# EAGLE design Final (EAGLE 9.3.0)
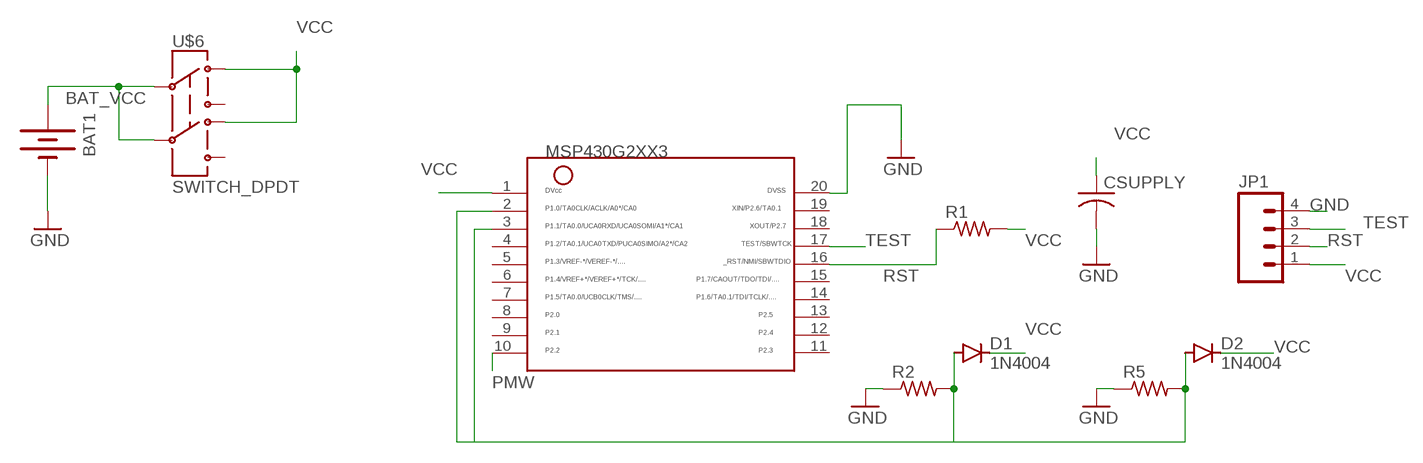
[diagram p0: schematic, sheet 1]

## Parts
BAT1  BATTERY  [BATTERY_PACK_2AA]
CSUPPLY  C-USC1206  [C1206]
D1  1N4004  [DO41-10]
D2  1N4004  [DO41-10]
JP1  M04LOCK  [1X04_LOCK]
R1  R-US_R1206  [R1206]
R2  R-US_R1206  [R1206]
R5  R-US_R1206  [R1206]
U$1  MSP430G2XX3TSSOP  [PW20]
U$6  SWITCH_DPDT  [JS_DPDT_TH]

## Nets
BAT_VCC: BAT1.3V(+) U$6.2 U$6.5
GND: BAT1.GND(-) CSUPPLY.2 JP1.4 R2.1 R5.1 U$1.20
N$1: D1.A R2.2 U$1.2
N$3: D2.A R5.2 U$1.3
PMW: U$1.10
RST: JP1.2 R1.1 U$1.16
TEST: JP1.3 U$1.17
VCC: CSUPPLY.1 D1.C D2.C JP1.1 R1.2 U$1.1 U$6.1 U$6.4
Unconnected: U$1.4 U$1.5 U$1.6 U$1.7 U$1.8 U$1.9 U$1.11 U$1.12 U$1.13 U$1.14 U$1.15 U$1.18 U$1.19 U$6.3 U$6.6

## Library data of the parts
BAT1 = ELEC327:BATTERY: Battery Holders Various common sizes : AA, AAA, 20mm coin cell and 12mm coin cell. 20MM_4LEGS, BATT-10373
CSUPPLY = rcl:C-US: CAPACITOR, American symbol
D1 D2 = diode:1N4004: DIODE general purpose rectifier, 1 A
JP1 = SparkFun:M04: Header 4 Standard 4-pin 0.1" header. Use with straight break away headers (SKU : PRT-00116), right angle break away headers (PRT-00553), swiss pins (PRT-00743), machine pins (PRT-00117), and female headers (PRT-00115). Molex polarized connector foot print use with SKU : PRT-08231 with associated crimp pins and housings. 1MM SMD Version SKU: PRT-10208
R1 R2 R5 = resistor:R-US_: RESISTOR, American symbol
U$1 = ELEC327:MSP430G2XX3: MSP430G2XX3 PDIP (N) 20 Pin Package
U$6 = ELEC327:SWITCH_DPDT

## Board
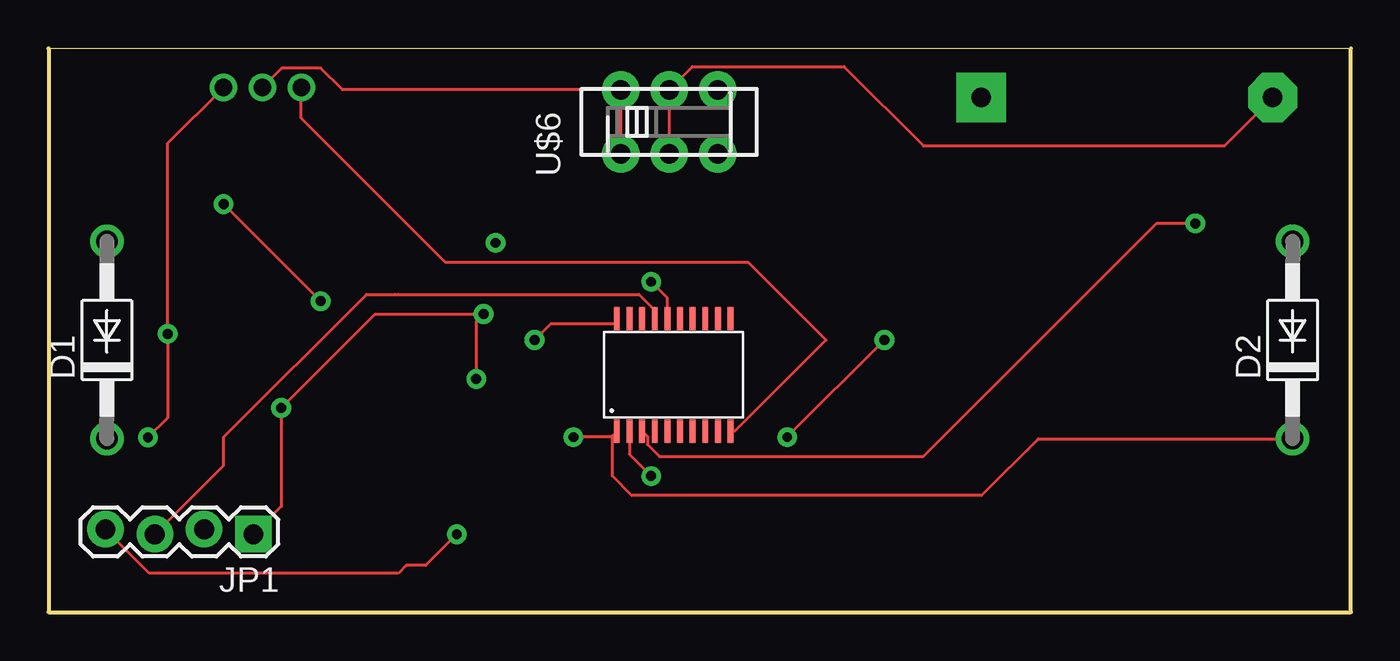
[diagram p1: board, top side]
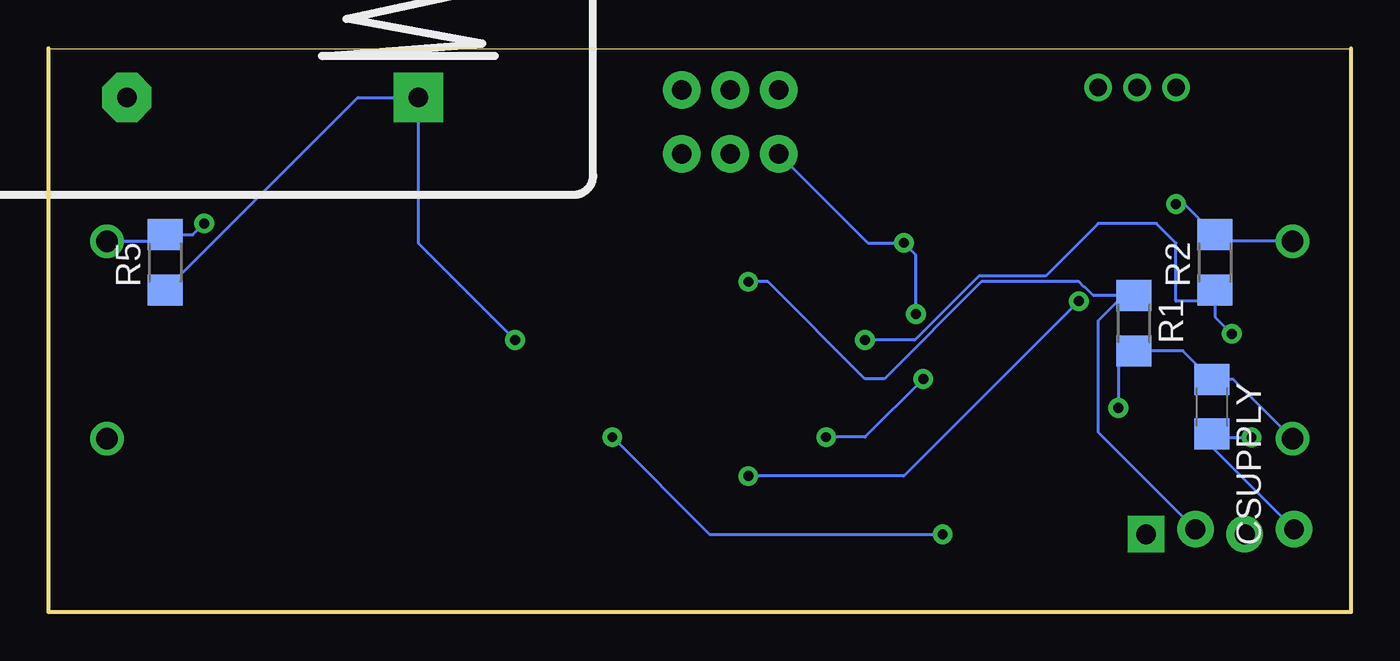
[diagram p2: board, bottom side, seen from below]

Size 67 x 29 mm. Coordinates in mm from the lower left corner, seen from the top.
Outline: 0,0 67,0 67,29 0,29 0,0
Copper layers (1*16): Top 0.035mm / dielectric 1.5mm / Bottom 0.035mm
Design rules "AdvancedCircuitsBarebones": minimum track width 6mil, minimum drill 20mil, track to track 6mil, track to pad 6mil, pad to pad 6mil, via to via 6mil, smd to smd 6mil, copper to edge 10mil, drill to drill 6mil, minimum pad ring 12mil, minimum via ring 10mil, stop-mask expansion 4mil, vias tented up to drill 25mil, thermal gap 10mil

### Footprints (pad centres in the part's own frame; a part is rotated, then mirrored left to right if it is on the bottom)
BATTERY_PACK_2AA = drill 1 pad 2.54 octagon: 3V 7.5,25 | drill 1 pad 2.54 square: GND -7.5,25
C1206 = smd 1.6 x 1.8: 1 -1.4,0; 2 1.4,0
DO41-10 = drill 1.118: A 5.08,0; C -5.08,0
1X04_LOCK = drill 1.016 pad 1.88 square: 1 0,0.127 | drill 1.016 pad 1.88: 2 2.54,-0.127; 3 5.08,0.127; 4 7.62,-0.127
R1206 = smd 1.6 x 1.803: 1 -1.422,0; 2 1.422,0
PW20 = smd 0.3 x 1.2: 1 -2.925,-2.9; 2 -2.275,-2.9; 3 -1.625,-2.9; 4 -0.975,-2.9; 5 -0.325,-2.9; 6 0.325,-2.9; 7 0.975,-2.9; 8 1.625,-2.9; 9 2.275,-2.9; 10 2.925,-2.9; 11 2.925,2.9; 12 2.275,2.9; 13 1.625,2.9; 14 0.975,2.9; 15 0.325,2.9; 16 -0.325,2.9; 17 -0.975,2.9; 18 -1.625,2.9; 19 -2.275,2.9; 20 -2.925,2.9
JS_DPDT_TH = drill 1 pad 1.93: 1 -2.5,-1.65; 2 0,-1.65; 3 2.5,-1.65; 4 -2.5,1.65; 5 0,1.65; 6 2.5,1.65

### Placement (x,y rotation side)
BAT1  55.48,51.48 180 bottom
CSUPPLY  7.16,10.56 270 bottom
D1  3,14 90 top
D2  64,14 90 top
JP1  10.54,4.13 180 top
R1  11.16,14.86 270 bottom
R2  7,18 90 bottom
R5  61,18 90 bottom
U$1  32.16,12.21 0 top
U$6  31.93,25.23 0 top

### Tracks (layer width: path | path; a pad name or v marks a point on that pad's centre or on a via)
BAT_VCC
  Top 0.152: U$6.2 U$6.5 33.12,28.07 40.93,28.07 45,24 60.5,24 BAT1.3V
GND  (via drill 0.51, 0.9)
  Top 0.152: U$1.20 29.23,14.84 25.84,14.84 v25,14 | v5.11,8.98 6.13,10 v6.13,14.32 6.13,24.13 v9,27 | JP1.4 5.18,2 18,2 18.4,2.4 19.4,2.4 v21,4 | v43,14 v38,9
  Bottom 0.152: R5.1 51.1,26.48 BAT1.GND 47.98,18.98 v43,14 | JP1.4 7.16,8.5 CSUPPLY.2 6.98,8.98 v5.11,8.98 | v6.13,14.32 7,15.19 R2.1 7.58,16 9,16 9,19 10,20 13,20 15.7,17.3 19.13,17.3 22.43,14 v25,14 | v38,9 33,4 v21,4
N$1  (via drill 0.51)
  Top 0.152: v9,21 v14,16 | U$1.2 29.88,8.12 v31,7
  Bottom 0.152: D1.A 6.66,19.08 R2.2 8.58,21 v9,21 | v14,16 23,7 v31,7
N$3  (via drill 0.51)
  Top 0.152: v59,20 57,20 45,8 31.42,8 30.81,8.62 30.81,9.04 U$1.3
  Bottom 0.152: D2.A 61.34,19.08 R5.2 59.58,19.42 v59,20
PMW  (via drill 0.9)
  Top 0.152: U$1.10 35.31,9.31 40,14 36,18 20.42,18 13,25.42 v13,27
RST  (via drill 0.51)
  Top 0.152: U$1.16 31.84,16.16 v31,17
  Bottom 0.152: JP1.2 13,9.26 13,15 11.72,16.28 R1.1 13.24,16.28 13.7,16.74 13.74,16.74 14,17 19,17 24,12 25,12 30,17 v31,17
TEST
  Top 0.152: U$1.17 31.18,15.53 30.37,16.35 18,16.35 17.81,16.35 16.35,16.35 9,9 9,7.54 JP1.3
VCC  (via drill 0.51, 0.9)
  Top 0.152: U$6.1 U$6.4 15.12,26.88 14,28 12,28 v11,27 | 29,9.07 29,7 30,6 48,6 50.92,8.92 D2.C | v22,12 22,14.95 v22.38,15.33 16.79,15.33 v11.97,10.51 11.97,5.43 JP1.1 | 29,9.07 28.93,9 v27,9 | 29,9.07 U$1.1
  Bottom 0.152: v11.97,10.51 11.97,12.63 R1.2 8.64,13.44 CSUPPLY.1 6.04,11.96 D1.C | v22.38,15.33 22.38,18.38 v23,19 24.85,19 U$6.1 | v22,12 25,9 v27,9